# Altium schematic sheet FPP Connector.SchDoc: Debug Interface
size Letter; SheetNumber: 17
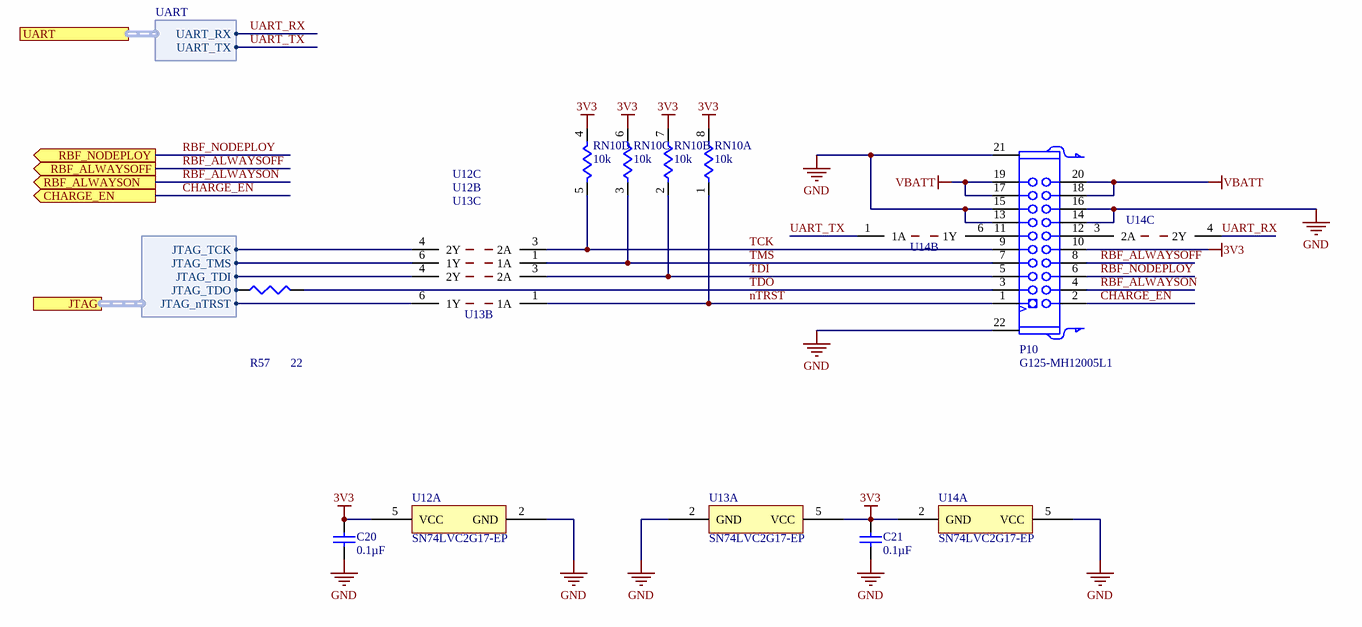
[diagram p0: FPP Connector.SchDoc]

## Parts
C20  value 0.1µF  [TDK-CGA2B]  (hidden comment: Cap)
C21  value 0.1µF  [TDK-CGA2B]  (hidden comment: Cap)
P10  G125-MH12005L1  [HWN-G125-MH12005L1]
R57  value 22  [PANA-ERJ2R]  (hidden comment: Res3)
RN10  value 10k  [PANA-EXB28V]  (hidden comment: Res4 Pack1)  (parts A,B,C,D of 4)
U12  SN74LVC2G17-EP  [TI-R-PDSO-G6]  (parts A,B,C of 3)
U13  SN74LVC2G17-EP  [TI-R-PDSO-G6]  (parts A,B,C of 3)
U14  SN74LVC2G17-EP  [TI-R-PDSO-G6]  (parts A,B,C of 3)

## Ports
CHARGE_EN (out), JTAG (harness DEBUG_JTAG), RBF_ALWAYSOFF (out), RBF_ALWAYSON (out), RBF_NODEPLOY (out), UART (harness UART)

## Harnesses
DEBUG_JTAG: JTAG_TMS, JTAG_TCK, JTAG_TDO, JTAG_TDI, JTAG_nTRST
UART: UART_TX, UART_RX

## Nets
3V3: C20.1 C21.1 P10.10 RN10.4 RN10.6 RN10.7 RN10.8 U12.5(VCC) U13.5(VCC) U14.2(GND)
GND: C20.2 C21.2 P10.13 P10.14 P10.15 P10.16 P10.21 P10.22 U12.2(GND) U13.2(GND) U14.5(VCC)
VBATT: P10.17 P10.18 P10.19 P10.20
CHARGE_EN: P10.2 ; port CHARGE_EN
nTRST: P10.1 RN10.1 U13.1(1A)
RBF_ALWAYSOFF: P10.8 ; port RBF_ALWAYSOFF
RBF_ALWAYSON: P10.4 ; port RBF_ALWAYSON
RBF_NODEPLOY: P10.6 ; port RBF_NODEPLOY
TCK: P10.9 RN10.5 U12.3(2A)
TDI: P10.5 RN10.2 U13.3(2A)
TDO: P10.3 R57.2
TMS: P10.7 RN10.3 U12.1(1A)
UART_RX: U14.4(2Y) ; port UART.UART_RX
UART_TX: U14.1(1A) ; port UART.UART_TX
NetP10_11: P10.11 U14.6(1Y)
NetP10_12: P10.12 U14.3(2A)
NetR57_1: R57.1 ; port JTAG.JTAG_TDO
NetU12_4: U12.4(2Y) ; port JTAG.JTAG_TCK
NetU12_6: U12.6(1Y) ; port JTAG.JTAG_TMS
NetU13_4: U13.4(2Y) ; port JTAG.JTAG_TDI
NetU13_6: U13.6(1Y) ; port JTAG.JTAG_nTRST

## Notes on the sheet
- (the "License"); you may not use or redistribute this file except in compliance with the License. You
- This file and the information within it are licensed under the terms of the Apache License, Version 2.0
- Copyright
- Unless required by applicable law or agreed to in writing, content distributed under the License is
- distributed on an "AS IS" BASIS, WITHOUT WARRANTIES OR CONDITIONS OF ANY KIND,
- either express or implied. See the License for the specific language governing permissions and
- limitations under the License.
- may obtain a copy of the License at:
- http://www.apache.org/licenses/LICENSE-2.0
- Title
- Size:
- Date:
- Letter
- Number:
- Time:
- Revision:
- Sheet
- of
- University of Alberta
- Deptartment of Electrical
- and Computer Engineering
- Edmonton AB, Canada
- T6G 1H9
- File:

## Library data of the parts
C20 C21 = PC-TDK-02259: CAP CER 0.1UF 50V X7R 0402; Manufacturer Part Number: CGA2B3X7R1H104K050BB; Index: 2259; Designator: C?; Tolerance: ±10%; Published: 2016-03-16; LatestRevisionDate: 2016-03-16; LatestRevisionNote: ...; PackageReference: 0402 (1005 Metric); Publisher: AlbertaSat; PackageDescription: Radial Cap, Thru-Hole; 2 Leads; 0.3 in Pin Spacing; Part Number: PC-TDK-02259; Supplier Part Number 1: 445-6899-1-ND; Supplier 1: Digi-key; Supplier Link: http://www.digikey.ca/product-search/en?keywords=445-6899-1-ND; Voltage - Rated: 50V; Temperature Coefficient: X7R; Applications: Automotive; Operating Temperature: -55°C ~ 125°C
P10 = PP-HWN-00018: CONN HEADER R/A 20POS 1.25MM; Index: 18; Designator: P?; Part Number: PP-HWN-00018; Manufacturer Part Number: G125-MH12005L1P; Supplier Part Number 1: 952-2699-ND; Supplier 1: Digi-key; Supplier Part Number 2: 855-G125-MH12005L1P; Supplier 2: Mouser; Publisher: AlbertaSat; Published: 2019-07-08; LatestRevisionDate: 2023-05-04; LatestRevisionNote: Added operating temperature; Supplier Link: https://www.digikey.ca/products/en?keywords=952-2699-ND; Operating Temperature: -65°C ~ 150°C
R57 = 13460: RES SMD 22 OHM 1% 1/10W 0402; Part Number: 13460; Manufacturer Part Number: ERJ-2RKF22R0X; Designator: R?; Power: 0.1W, 1/10W; Temperature Coefficient: ±100ppm/°C; Published: 8-Jun-2000; LatestRevisionDate: 29-May-2009; LatestRevisionNote: IPC-7351 Footprint Added.; PackageReference: 0402 (1005 Metric); Publisher: Altium Limited; PackageDescription: Chip Resistor, 2-Leads, Body 1.00x0.50mm, IPC Low Density; Supplier Part Number 1: P22.0LCT-ND; Supplier 1: Digi-Key; Supplier Link: http://www.digikey.ca/product-search/en?keywords=P22.0LCT-ND; Tolerance: ±1%; Operating Temperature: -55°C ~ 155°C
RN10 = 19968: RES ARRAY 4 RES 10K OHM 0804; Part Number: 19968; Manufacturer Part Number: EXB-28V103JX; Sim Note: Enter the Resistance value into parameter field.; Designator: RN?; Tolerance: ±5%; Power: 62.5mW; Temperature Coefficient: ±200ppm/°C; Code_JEDEC: MS-012-AC; Supplier Part Number 1: Y7103CT-ND; Supplier 1: Digi-Key; Supplier Link: http://www.digikey.ca/product-search/en?keywords=Y7103CT-ND; PackageReference: 0804, Convex, Long Side Terminals; Operating Temperature: -55°C ~ 125°C
U12-U14 = 92: IC BUF NON-INVERT 5.5V SC70-6; Part Number: 92; Manufacturer Part Number: SN74LVC2G17MDCKREP; Designator: U?; Voltage - Supply: 1.65V ~ 5.5V; Supplier Part Number 2: 595-SN74L2G17MDCKREP; Supplier 2: Mouser; Supplier Part Number 1: 296-22358-1-ND; Supplier 1: Digi-Key; Supplier Link: #https://www.digikey.ca/product-detail/en/texas-instruments/SN74LVC2G17MDCKREP/296-22358-1-ND/1666931#; PackageReference: SC70; Operating Temperature: -55°C ~ 125°C (TA)